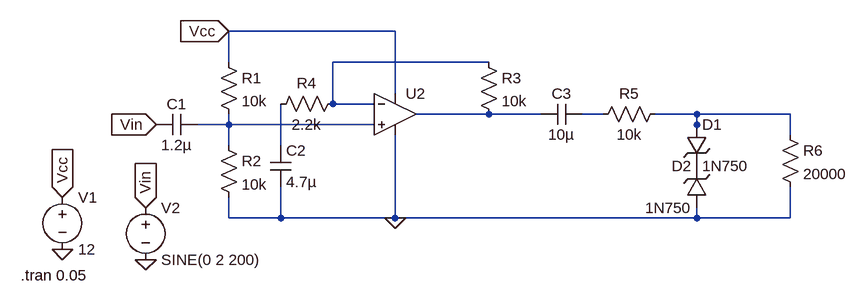
[diagram p0: schematic Distortion.asc]
Distortion.asc, the LTspice schematic file:
Version 4.1
SHEET 1 880 680
WIRE 160 32 -96 32
WIRE -96 80 -96 32
WIRE 304 80 64 80
WIRE 160 128 160 32
WIRE 64 144 64 80
WIRE 128 144 64 144
WIRE 304 160 192 160
WIRE 384 160 304 160
WIRE 480 160 448 160
WIRE 624 160 560 160
WIRE 768 160 624 160
WIRE -96 176 -96 160
WIRE -96 176 -144 176
WIRE 128 176 -96 176
WIRE 624 176 624 160
WIRE 624 192 624 176
WIRE 768 192 768 160
WIRE -96 208 -96 176
WIRE -16 208 -16 144
WIRE -96 320 -96 288
WIRE -16 320 -16 272
WIRE -16 320 -96 320
WIRE 160 320 160 192
WIRE 160 320 -16 320
WIRE 624 320 624 304
WIRE 624 320 160 320
WIRE 768 320 768 272
WIRE 768 320 624 320
FLAG 160 320 0
FLAG -352 368 0
FLAG -352 288 Vcc
IOPIN -352 288 In
FLAG -96 32 Vcc
IOPIN -96 32 In
FLAG -224 384 0
FLAG -224 304 Vin
IOPIN -224 304 In
FLAG -208 176 Vin
IOPIN -208 176 In
SYMBOL res -112 64 R0
SYMATTR InstName R1
SYMATTR Value 10k
SYMBOL res -112 192 R0
SYMATTR InstName R2
SYMATTR Value 10k
SYMBOL cap -144 160 R90
WINDOW 0 0 32 VBottom 2
WINDOW 3 32 32 VTop 2
SYMATTR InstName C1
SYMATTR Value 1.2µ
SYMBOL res 288 64 R0
SYMATTR InstName R3
SYMATTR Value 10k
SYMBOL res 80 128 R90
WINDOW 0 0 56 VBottom 2
WINDOW 3 32 56 VTop 2
SYMATTR InstName R4
SYMATTR Value 2.2k
SYMBOL cap -32 208 R0
SYMATTR InstName C2
SYMATTR Value 4.7µ
SYMBOL voltage -352 272 R0
WINDOW 123 0 0 Left 0
WINDOW 39 0 0 Left 0
SYMATTR InstName V1
SYMATTR Value 12
SYMBOL voltage -224 288 R0
WINDOW 123 0 0 Left 0
WINDOW 39 0 0 Left 0
SYMATTR InstName V2
SYMATTR Value SINE(0 2 200)
SYMBOL cap 448 144 R90
WINDOW 0 0 32 VBottom 2
WINDOW 3 32 32 VTop 2
SYMATTR InstName C3
SYMATTR Value 10µ
SYMBOL zener 608 176 R0
SYMATTR InstName D1
SYMATTR Value 1N750
SYMBOL zener 640 304 R180
WINDOW 0 24 64 Left 2
WINDOW 3 24 0 Left 2
SYMATTR InstName D2
SYMATTR Value 1N750
SYMBOL res 576 144 R90
WINDOW 0 0 56 VBottom 2
WINDOW 3 32 56 VTop 2
SYMATTR InstName R5
SYMATTR Value 10k
SYMBOL res 752 176 R0
SYMATTR InstName R6
SYMATTR Value 20000
SYMBOL OpAmps\\UniversalOpAmp2 160 160 R0
SYMATTR InstName U2
TEXT -416 408 Left 2 !.tran 0.05

The netlist it stands for:
* Distortion.asc
R1 Vcc N005 10k
R2 N005 0 10k
C1 N005 Vin 1.2µ
R3 N001 N002 10k
R4 N001 N006 2.2k
C2 N006 0 4.7µ
V1 Vcc 0 12
V2 Vin 0 SINE(0 2 200)
C3 N003 N002 10µ
D1 N004 P001 1N750
D2 0 P001 1N750
R5 N004 N003 10k
R6 N004 0 20000
X§U2 N005 N001 Vcc 0 N002 level2 Avol=1Meg GBW=10Meg Slew=10Meg Ilimit=25m Rail=0 Vos=0 En=0 Enk=0 In=0 Ink=0 Rin=500Meg  ; pins In+ In- V+ V- OUT
.model D D
.lib standard.dio
.tran 0.05
.lib UniversalOpAmp2.lib
.backanno
.end